# EAGLE schematic TCU_UCU_PCB_Rev2 (EAGLE 9.6.2)

## Sheet 1 of 7
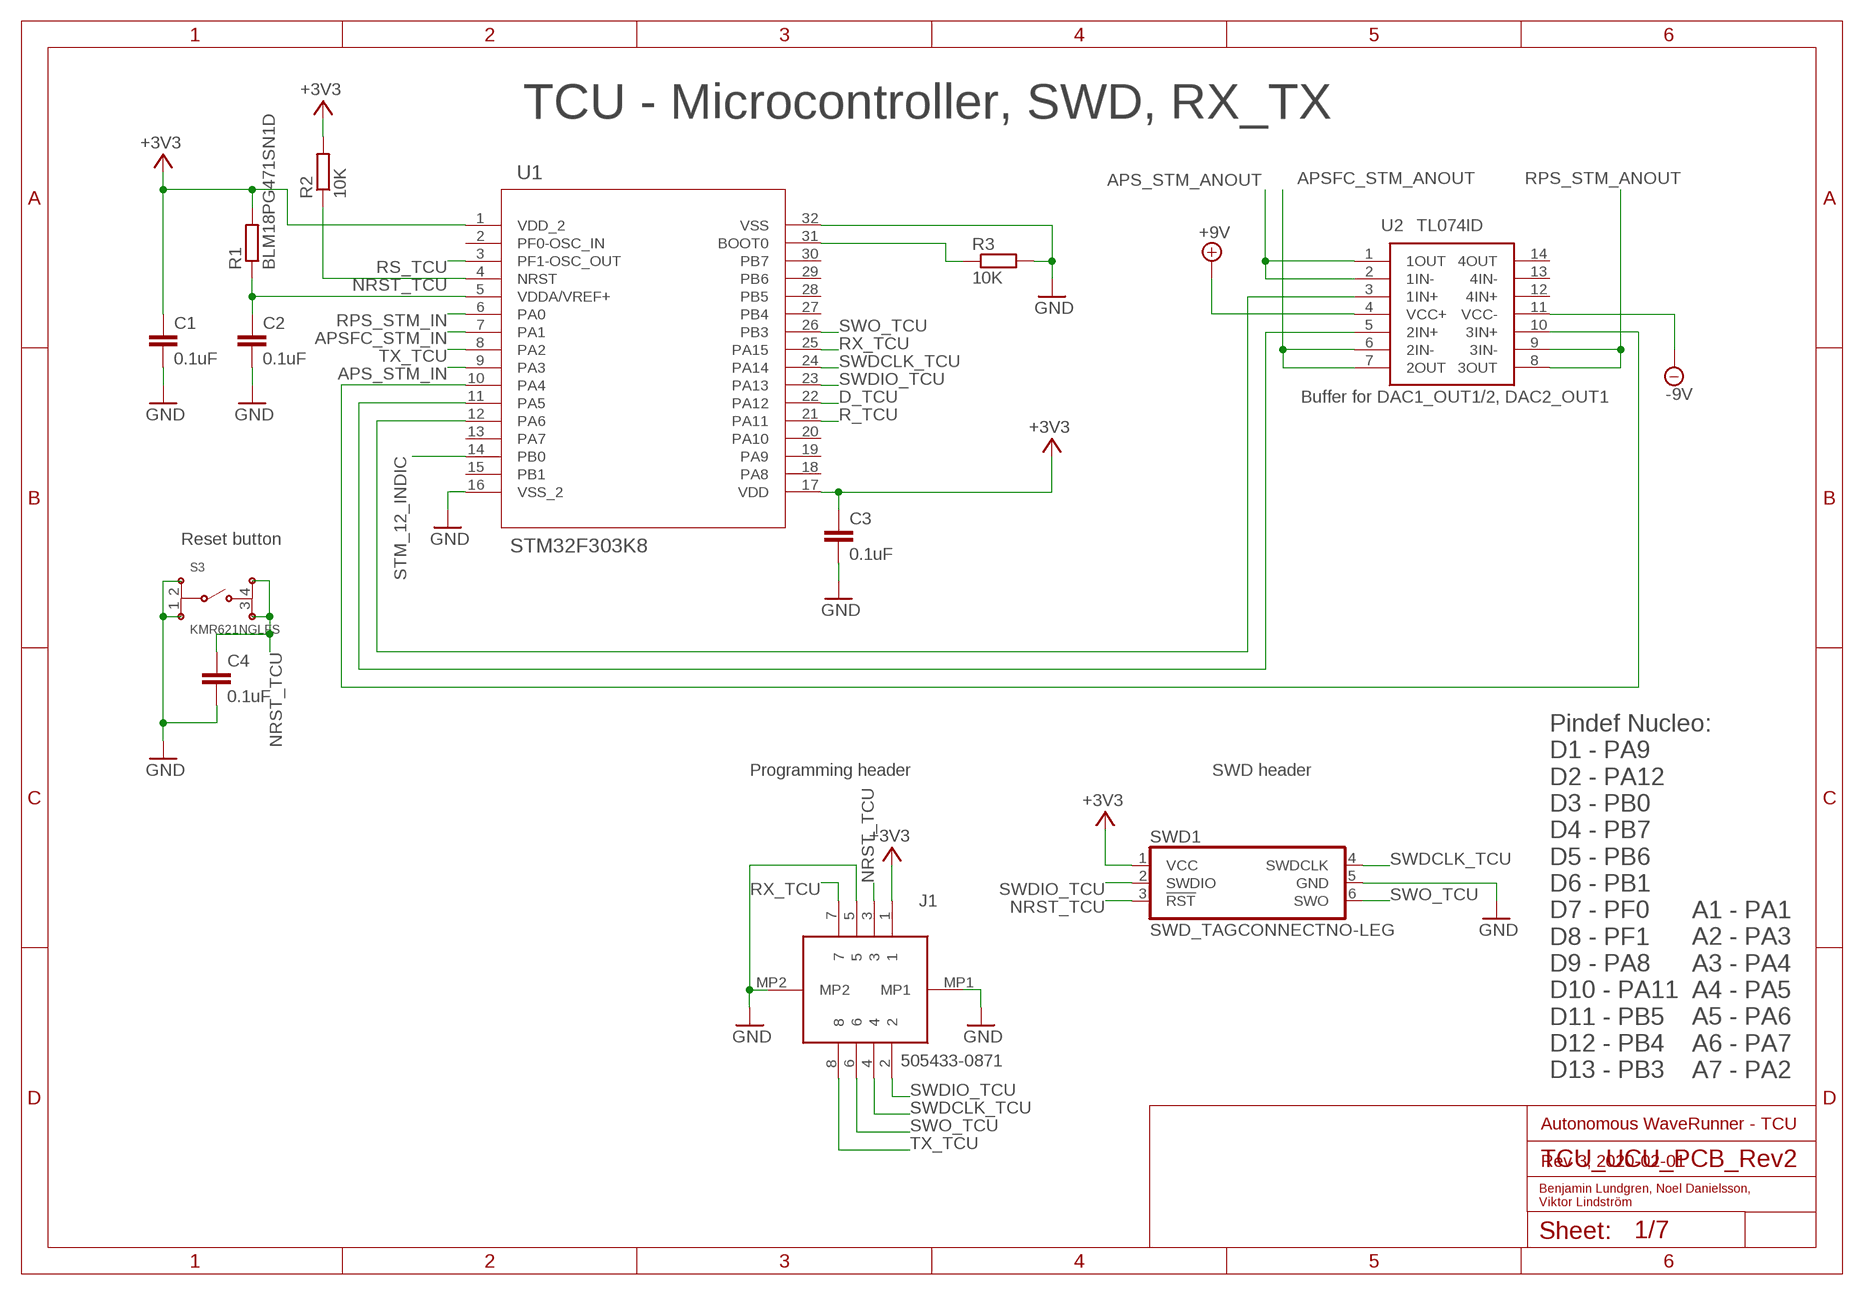
[diagram p0: schematic, sheet 1]

### Parts
C1  0.1uF  C0603  [C0603]
C2  0.1uF  C0603  [C0603]
C3  0.1uF  C0603  [C0603]
C4  0.1uF  C0603  [C0603]
J1  505433-0871  [5054330871]
R1  BLM18PG471SN1D  R0603  [R0603]
R2  10K  R0603  [R0603]
R3  10K  R0603  [R0603]
S3  KMR621NGLFS  [KMR621NGLFS]
SWD1  SWD_TAGCONNECTNO-LEG  [TC2030-IDC-NL]
U1  STM32F303K8  [LQFP-32]
U2  TL074ID  [SOIC127P600X175-14N]

### Nets
+3V3: C1.1 C3.1 J1.1 R1.2 R2.2 SWD1.1(VCC) U1.1(VDD_2) U1.17(VDD) ; also sheet 2,3,5,6,7
+9V: U2.4(VCC+) ; also sheet 3,4
-9V: U2.11(VCC-) ; also sheet 3,4
APS_STM_ANOUT: U2.1(1OUT) U2.2(1IN-) ; also sheet 4
APS_STM_IN: U1.9(PA3) ; also sheet 4
APSFC_STM_ANOUT: U2.6(2IN-) U2.7(2OUT) ; also sheet 4
APSFC_STM_IN: U1.7(PA1) ; also sheet 4
D_TCU: U1.22(PA12) ; also sheet 7
GND: C1.2 C2.2 C3.2 C4.2 J1.5 J1.MP1 J1.MP2 R3.2 S3.1 S3.2 SWD1.5(GND) U1.16(VSS_2) U1.32(VSS) ; also sheet 2,3,4,5,6,7
N$7: U1.11(PA5) U2.5(2IN+)
N$8: U1.12(PA6) U2.3(1IN+)
N$9: U1.10(PA4) U2.10(3IN+)
N$26: C2.1 R1.1 U1.5(VDDA/VREF+)
N$27: R3.1 U1.31(BOOT0)
NRST_TCU: C4.1 J1.3 R2.1 S3.3 S3.4 SWD1.3(!RST) U1.4(NRST)
R_TCU: U1.21(PA11) ; also sheet 7
RPS_STM_ANOUT: U2.8(3OUT) U2.9(3IN-) ; also sheet 4
RPS_STM_IN: U1.6(PA0) ; also sheet 4
RS_TCU: U1.3(PF1-OSC_OUT) ; also sheet 7
RX_TCU: J1.7 U1.25(PA15)
STM_12_INDIC: U1.14(PB0) ; also sheet 2,3,6
SWDCLK_TCU: J1.4 SWD1.4(SWDCLK) U1.24(PA14)
SWDIO_TCU: J1.2 SWD1.2(SWDIO) U1.23(PA13)
SWO_TCU: J1.6 SWD1.6(SWO) U1.26(PB3)
TX_TCU: J1.8 U1.8(PA2)
Unconnected: U1.2(PF0-OSC_IN) U1.13(PA7) U1.15(PB1) U1.18(PA8) U1.19(PA9) U1.20(PA10) U1.27(PB4) U1.28(PB5) U1.29(PB6) U1.30(PB7) U2.12(4IN+) U2.13(4IN-) U2.14(4OUT)

### Notes on the sheet
- TCU - Microcontroller, SWD, RX_TX
- Buffer for DAC1_OUT1/2, DAC2_OUT1
- Reset button
- Programming header | SWD header
- Pindef Nucleo:
  D1 - PA9
  D2 - PA12
  D3 - PB0
  D4 - PB7
  D5 - PB6
  D6 - PB1
  D7 - PF0
  D8 - PF1
  D9 - PA8
  D10 - PA11
  D11 - PB5
  D12 - PB4
  D13 - PB3
- A1 - PA1
  A2 - PA3
  A3 - PA4
  A4 - PA5
  A5 - PA6
  A6 - PA7
  A7 - PA2
- Autonomous WaveRunner - TCU
- Rev 3, 2020-02-01
- Benjamin Lundgren, Noel Danielsson, 
  Viktor Lindström

## Sheet 2 of 7
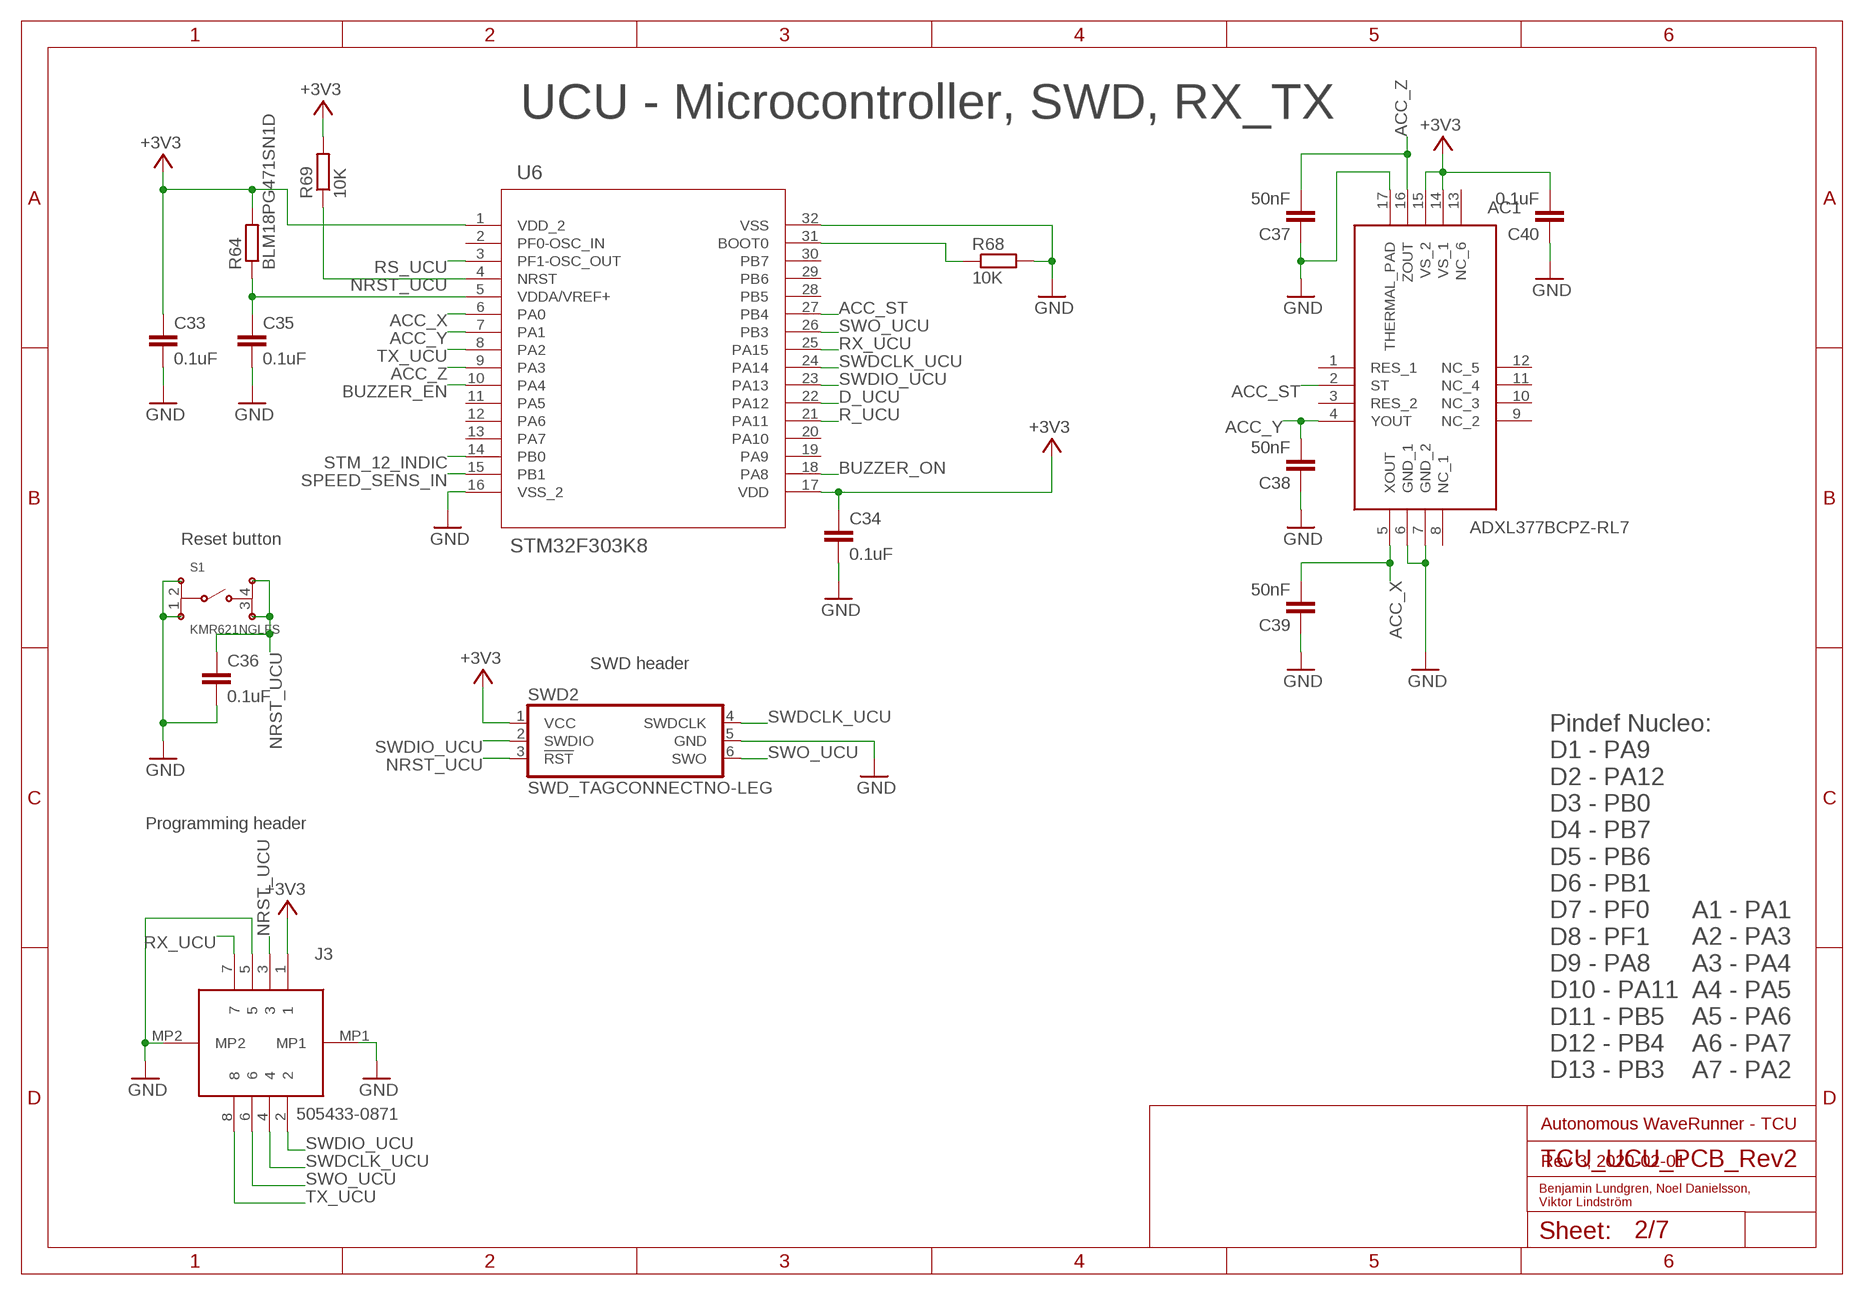
[diagram p1: schematic, sheet 2]

### Parts
AC1  ADXL377BCPZ-RL7  [QFN50P300X300X150-17N]
C33  0.1uF  C0603  [C0603]
C34  0.1uF  C0603  [C0603]
C35  0.1uF  C0603  [C0603]
C36  0.1uF  C0603  [C0603]
C37  50nF  C0603  [C0603]
C38  50nF  C0603  [C0603]
C39  50nF  C0603  [C0603]
C40  0.1uF  C0603  [C0603]
J3  505433-0871  [5054330871]
R64  BLM18PG471SN1D  R0603  [R0603]
R68  10K  R0603  [R0603]
R69  10K  R0603  [R0603]
S1  KMR621NGLFS  [KMR621NGLFS]
SWD2  SWD_TAGCONNECTNO-LEG  [TC2030-IDC-NL]
U6  STM32F303K8  [LQFP-32]

### Nets
+3V3: AC1.14(VS_1) AC1.15(VS_2) C33.1 C34.1 C40.2 J3.1 R64.2 R69.2 SWD2.1(VCC) U6.1(VDD_2) U6.17(VDD) ; also sheet 1,3,5,6,7
ACC_ST: AC1.2(ST) U6.27(PB4)
ACC_X: AC1.5(XOUT) C39.2 U6.6(PA0)
ACC_Y: AC1.4(YOUT) C38.2 U6.7(PA1)
ACC_Z: AC1.16(ZOUT) C37.2 U6.9(PA3)
BUZZER_EN: U6.10(PA4) ; also sheet 5
BUZZER_ON: U6.18(PA8) ; also sheet 5
D_UCU: U6.22(PA12) ; also sheet 7
GND: AC1.6(GND_1) AC1.7(GND_2) AC1.17(THERMAL_PAD) C33.2 C34.2 C35.2 C36.2 C37.1 C38.1 C39.1 C40.1 J3.5 J3.MP1 J3.MP2 R68.2 S1.1 S1.2 SWD2.5(GND) U6.16(VSS_2) U6.32(VSS) ; also sheet 1,3,4,5,6,7
N$40: C35.1 R64.1 U6.5(VDDA/VREF+)
N$61: R68.1 U6.31(BOOT0)
NRST_UCU: C36.1 J3.3 R69.1 S1.3 S1.4 SWD2.3(!RST) U6.4(NRST)
R_UCU: U6.21(PA11) ; also sheet 7
RS_UCU: U6.3(PF1-OSC_OUT) ; also sheet 7
RX_UCU: J3.7 U6.25(PA15)
SPEED_SENS_IN: U6.15(PB1) ; also sheet 5
STM_12_INDIC: U6.14(PB0) ; also sheet 1,3,6
SWDCLK_UCU: J3.4 SWD2.4(SWDCLK) U6.24(PA14)
SWDIO_UCU: J3.2 SWD2.2(SWDIO) U6.23(PA13)
SWO_UCU: J3.6 SWD2.6(SWO) U6.26(PB3)
TX_UCU: J3.8 U6.8(PA2)
Unconnected: AC1.1(RES_1) AC1.3(RES_2) AC1.8(NC_1) AC1.9(NC_2) AC1.10(NC_3) AC1.11(NC_4) AC1.12(NC_5) AC1.13(NC_6) U6.2(PF0-OSC_IN) U6.11(PA5) U6.12(PA6) U6.13(PA7) U6.19(PA9) U6.20(PA10) U6.28(PB5) U6.29(PB6) U6.30(PB7)

### Notes on the sheet
- UCU - Microcontroller, SWD, RX_TX
- Reset button
- SWD header
- Programming header
- Pindef Nucleo:
  D1 - PA9
  D2 - PA12
  D3 - PB0
  D4 - PB7
  D5 - PB6
  D6 - PB1
  D7 - PF0
  D8 - PF1
  D9 - PA8
  D10 - PA11
  D11 - PB5
  D12 - PB4
  D13 - PB3
- A1 - PA1
  A2 - PA3
  A3 - PA4
  A4 - PA5
  A5 - PA6
  A6 - PA7
  A7 - PA2
- Autonomous WaveRunner - TCU
- Rev 3, 2020-02-01
- Benjamin Lundgren, Noel Danielsson, 
  Viktor Lindström

## Sheet 3 of 7
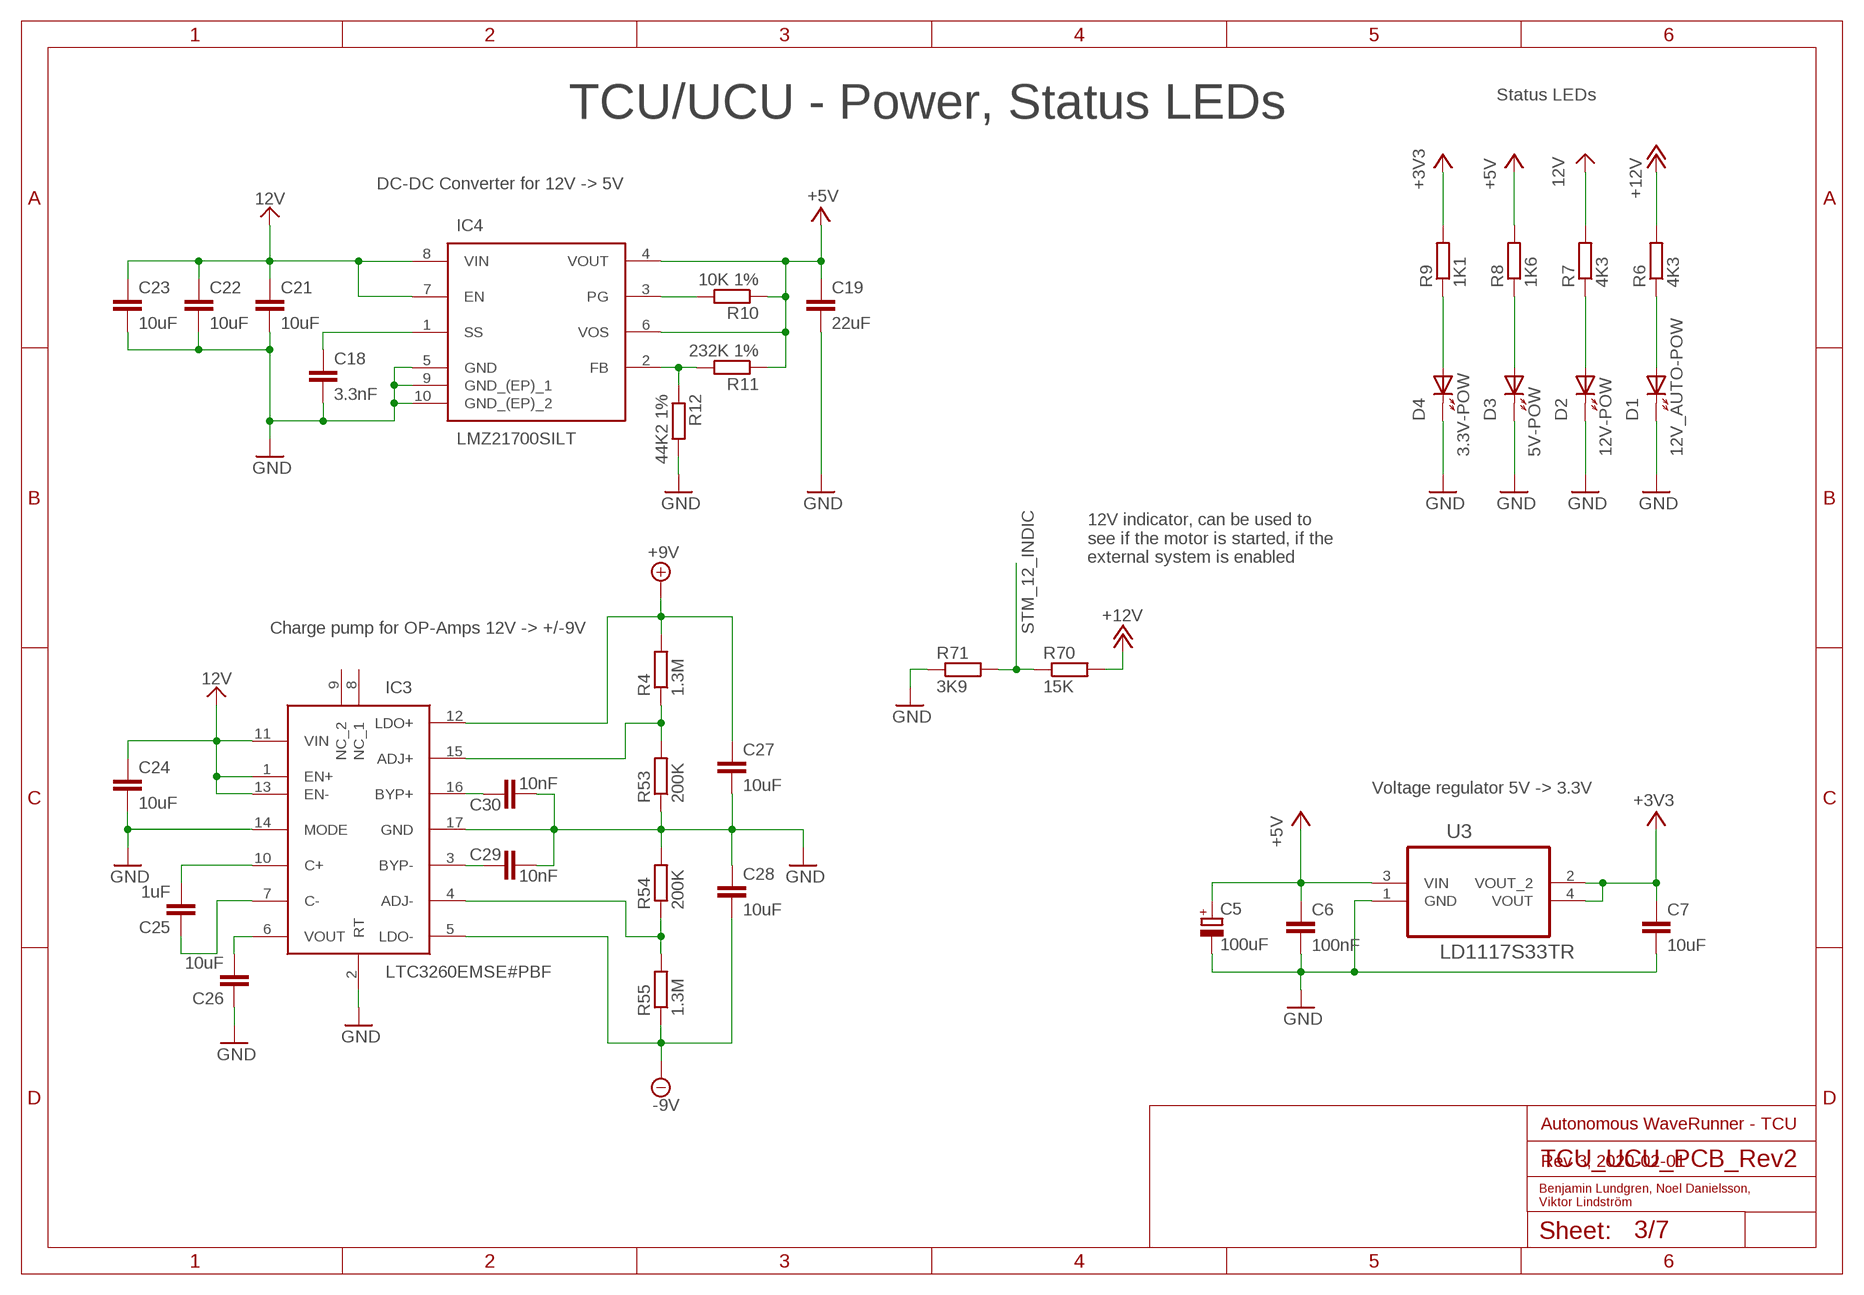
[diagram p2: schematic, sheet 3]

### Parts
C5  100uF  PANASONIC_C  [PANASONIC_C]
C6  100nF  C0603  [C0603]
C7  10uF  C0805  [C0805]
C18  3.3nF  C0603  [C0603]
C19  22uF  C0805  [C0805]
C21  10uF  C1206  [C1206]
C22  10uF  C1206  [C1206]
C23  10uF  C1206  [C1206]
C24  10uF  C1206  [C1206]
C25  1uF  C0805  [C0805]
C26  10uF  C1206  [C1206]
C27  10uF  C1206  [C1206]
C28  10uF  C1206  [C1206]
C29  10nF  C0603  [C0603]
C30  10nF  C0603  [C0603]
D1  12V_AUTO-POW  CHIP-LED0805  [CHIP-LED0805]
D2  12V-POW  CHIP-LED0805  [CHIP-LED0805]
D3  5V-POW  CHIP-LED0805  [CHIP-LED0805]
D4  3.3V-POW  CHIP-LED0805  [CHIP-LED0805]
IC3  LTC3260EMSE#PBF  [SOP50P490X110-17N]
IC4  LMZ21700SILT  [SIL0008E]
R4  1.3M  R0603  [R0603]
R6  4K3  R0603  [R0603]
R7  4K3  R0603  [R0603]
R8  1K6  R0603  [R0603]
R9  1K1  R0603  [R0603]
R10  10K 1%  R0603  [R0603]
R11  232K 1%  R0603  [R0603]
R12  44K2 1%  R0603  [R0603]
R53  200K  R0603  [R0603]
R54  200K  R0603  [R0603]
R55  1.3M  R0603  [R0603]
R70  15K  R0603  [R0603]
R71  3K9  R0603  [R0603]
U3  LD1117S33TR  [SOT230P700X180-4N]

### Nets
12V: C21.1 C22.1 C23.1 C24.1 IC3.1(EN+) IC3.11(VIN) IC3.13(EN-) IC4.7(EN) IC4.8(VIN) R7.2 ; also sheet 5,7
+3V3: C7.1 R9.2 U3.2(VOUT_2) U3.4(VOUT) ; also sheet 1,2,5,6,7
+5V: C5.+ C6.1 C19.1 IC4.4(VOUT) IC4.6(VOS) R8.2 R10.1 R11.1 U3.3(VIN) ; also sheet 5
+9V: C27.1 IC3.12(LDO+) R4.2 ; also sheet 1,4
+12V: R6.2 R70.2 ; also sheet 6,7
-9V: C28.2 IC3.5(LDO-) R55.1 ; also sheet 1,4
GND: C5.- C6.2 C7.2 C18.2 C19.2 C21.2 C22.2 C23.2 C24.2 C26.1 C27.2 C28.1 C29.2 C30.2 D1.C(K) D2.C(K) D3.C(K) D4.C(K) IC3.2(RT) IC3.14(MODE) IC3.17(GND) IC4.5(GND) IC4.9(GND_(EP)_1) IC4.10(GND_(EP)_2) R12.2 R53.1 R54.2 R71.1 U3.1(GND) ; also sheet 1,2,4,5,6,7
N$3: C25.2 IC3.10(C+)
N$4: D1.A R6.1
N$5: IC4.2(FB) R11.2 R12.1
N$6: C18.1 IC4.1(SS)
N$10: D2.A R7.1
N$11: IC4.3(PG) R10.2
N$12: C25.1 IC3.7(C-)
N$13: C26.2 IC3.6(VOUT)
N$14: IC3.15(ADJ+) R4.1 R53.2
N$16: IC3.4(ADJ-) R54.1 R55.2
N$17: D3.A R8.1
N$22: C30.1 IC3.16(BYP+)
N$23: C29.1 IC3.3(BYP-)
N$42: D4.A R9.1
STM_12_INDIC: R70.1 R71.2 ; also sheet 1,2,6
Unconnected: IC3.8(NC_1) IC3.9(NC_2)

### Notes on the sheet
- TCU/UCU - Power, Status LEDs | Status LEDs
- DC-DC Converter for 12V -> 5V
- 12V indicator, can be used to
  see if the motor is started, if the 
  external system is enabled
- Charge pump for OP-Amps 12V -> +/-9V
- Voltage regulator 5V -> 3.3V
- Autonomous WaveRunner - TCU
- Rev 3, 2020-02-01
- Benjamin Lundgren, Noel Danielsson, 
  Viktor Lindström

## Sheet 4 of 7
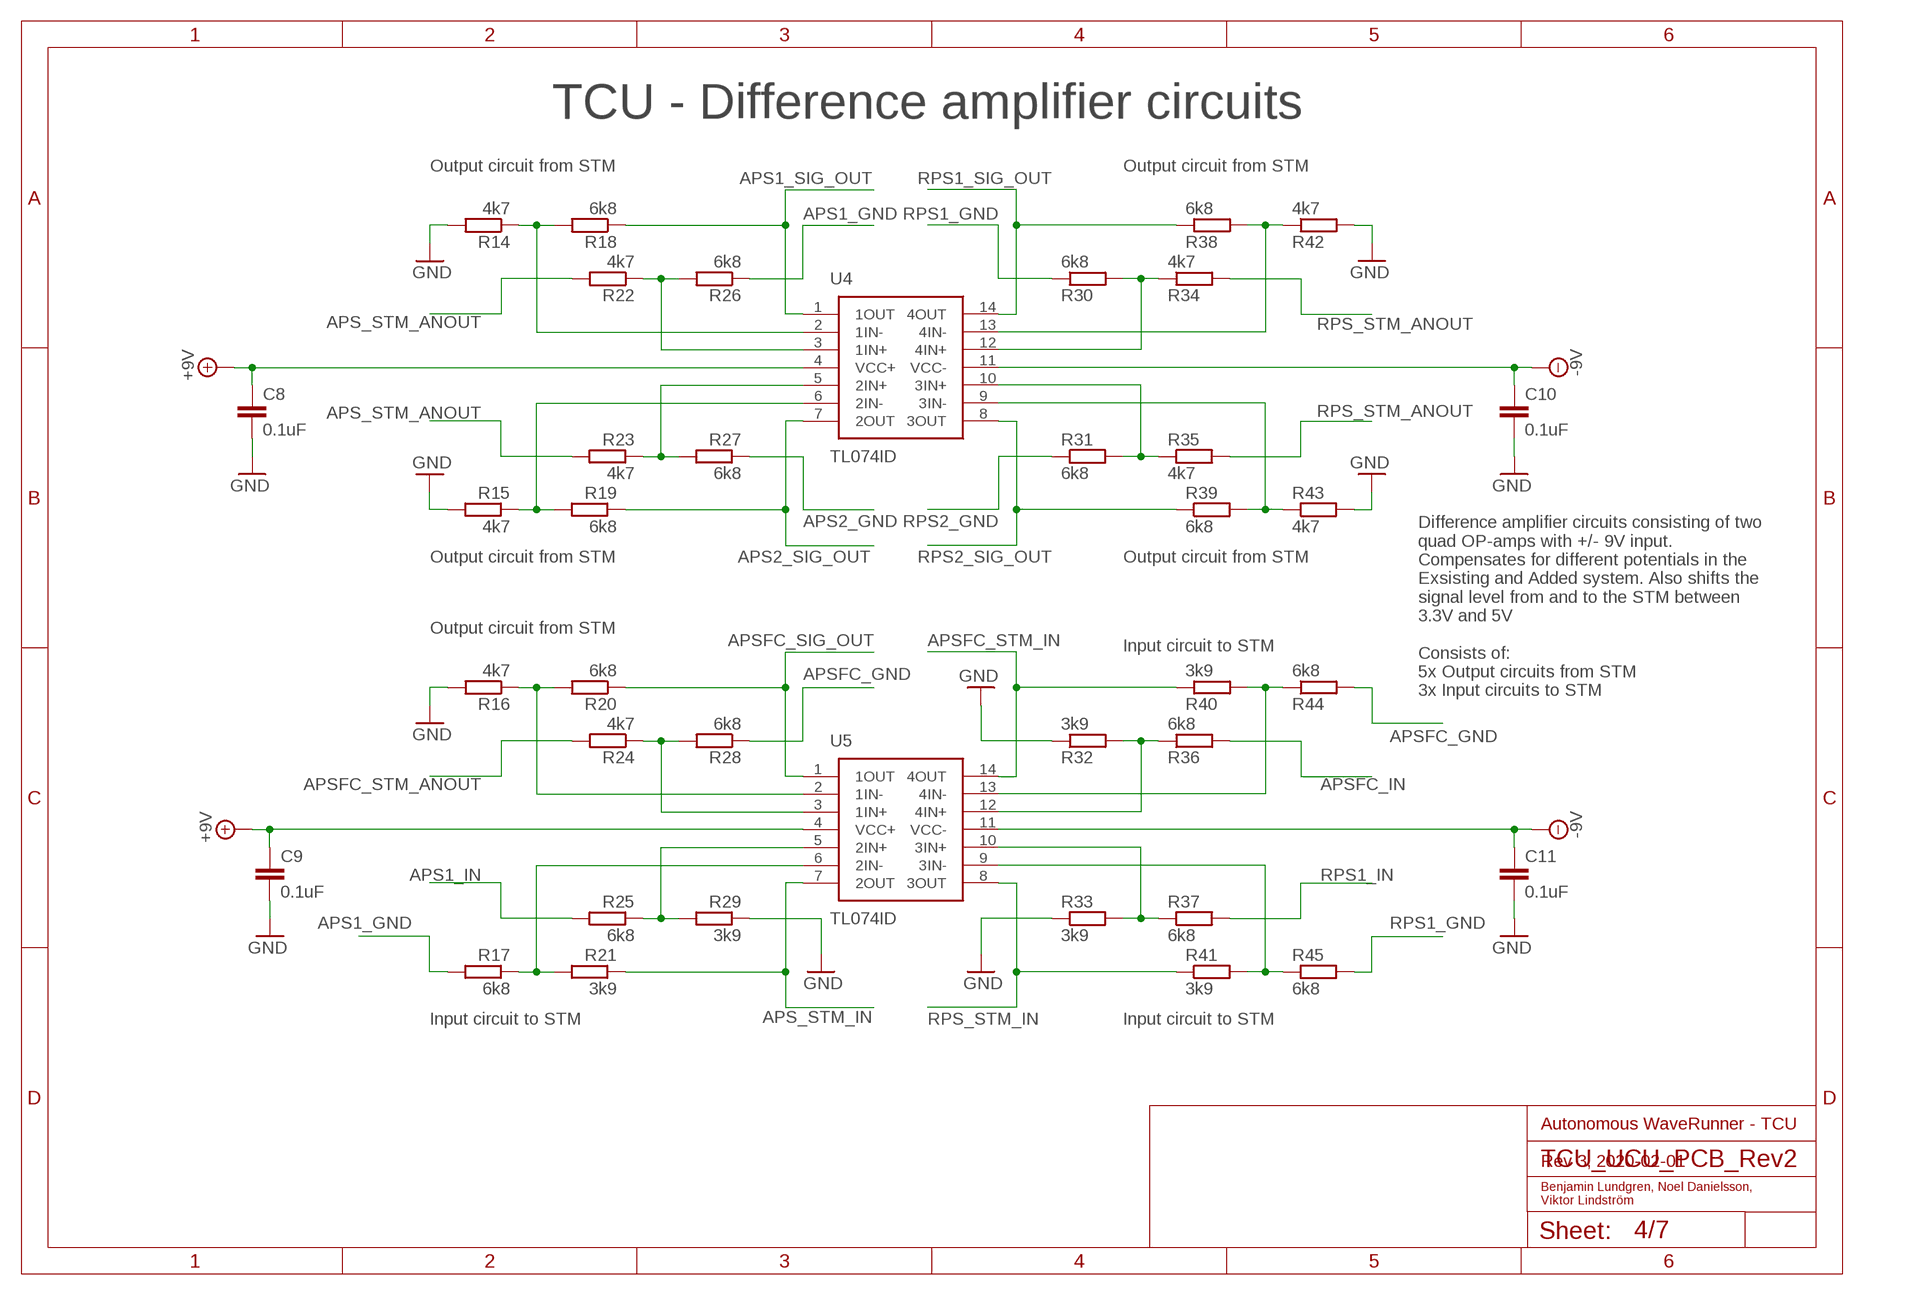
[diagram p3: schematic, sheet 4]

### Parts
C8  0.1uF  C0805  [C0805]
C9  0.1uF  C0805  [C0805]
C10  0.1uF  C0805  [C0805]
C11  0.1uF  C0805  [C0805]
R14  4k7  R0603  [R0603]
R15  4k7  R0603  [R0603]
R16  4k7  R0603  [R0603]
R17  6k8  R0603  [R0603]
R18  6k8  R0603  [R0603]
R19  6k8  R0603  [R0603]
R20  6k8  R0603  [R0603]
R21  3k9  R0603  [R0603]
R22  4k7  R0603  [R0603]
R23  4k7  R0603  [R0603]
R24  4k7  R0603  [R0603]
R25  6k8  R0603  [R0603]
R26  6k8  R0603  [R0603]
R27  6k8  R0603  [R0603]
R28  6k8  R0603  [R0603]
R29  3k9  R0603  [R0603]
R30  6k8  R0603  [R0603]
R31  6k8  R0603  [R0603]
R32  3k9  R0603  [R0603]
R33  3k9  R0603  [R0603]
R34  4k7  R0603  [R0603]
R35  4k7  R0603  [R0603]
R36  6k8  R0603  [R0603]
R37  6k8  R0603  [R0603]
R38  6k8  R0603  [R0603]
R39  6k8  R0603  [R0603]
R40  3k9  R0603  [R0603]
R41  3k9  R0603  [R0603]
R42  4k7  R0603  [R0603]
R43  4k7  R0603  [R0603]
R44  6k8  R0603  [R0603]
R45  6k8  R0603  [R0603]
U4  TL074ID  [SOIC127P600X175-14N]
U5  TL074ID  [SOIC127P600X175-14N]

### Nets
+9V: C8.1 C9.1 U4.4(VCC+) U5.4(VCC+) ; also sheet 1,3
-9V: C10.1 C11.1 U4.11(VCC-) U5.11(VCC-) ; also sheet 1,3
APS1_GND: R17.2 R26.1 ; also sheet 6
APS1_IN: R25.2 ; also sheet 6
APS1_SIG_OUT: R18.1 U4.1(1OUT) ; also sheet 6
APS2_GND: R27.1 ; also sheet 6
APS2_SIG_OUT: R19.1 U4.7(2OUT) ; also sheet 6
APS_STM_ANOUT: R22.2 R23.2 ; also sheet 1
APS_STM_IN: R21.1 U5.7(2OUT) ; also sheet 1
APSFC_GND: R28.1 R44.2 ; also sheet 6
APSFC_IN: R36.2 ; also sheet 6
APSFC_SIG_OUT: R20.1 U5.1(1OUT) ; also sheet 6
APSFC_STM_ANOUT: R24.2 ; also sheet 1
APSFC_STM_IN: R40.1 U5.14(4OUT) ; also sheet 1
GND: C8.2 C9.2 C10.2 C11.2 R14.2 R15.2 R16.2 R29.1 R32.1 R33.1 R42.2 R43.2 ; also sheet 1,2,3,5,6,7
N$31: R22.1 R26.2 U4.3(1IN+)
N$33: R14.1 R18.2 U4.2(1IN-)
N$39: R31.2 R35.1 U4.10(3IN+)
N$43: R39.2 R43.1 U4.9(3IN-)
N$44: R30.2 R34.1 U4.12(4IN+)
N$45: R38.2 R42.1 U4.13(4IN-)
N$46: R23.1 R27.2 U4.5(2IN+)
N$47: R15.1 R19.2 U4.6(2IN-)
N$48: R24.1 R28.2 U5.3(1IN+)
N$49: R16.1 R20.2 U5.2(1IN-)
N$50: R33.2 R37.1 U5.10(3IN+)
N$51: R41.2 R45.1 U5.9(3IN-)
N$52: R32.2 R36.1 U5.12(4IN+)
N$53: R40.2 R44.1 U5.13(4IN-)
N$54: R25.1 R29.2 U5.5(2IN+)
N$55: R17.1 R21.2 U5.6(2IN-)
RPS1_GND: R30.1 R45.2 ; also sheet 6
RPS1_IN: R37.2 ; also sheet 6
RPS1_SIG_OUT: R38.1 U4.14(4OUT) ; also sheet 6
RPS2_GND: R31.1 ; also sheet 6
RPS2_SIG_OUT: R39.1 U4.8(3OUT) ; also sheet 6
RPS_STM_ANOUT: R34.2 R35.2 ; also sheet 1
RPS_STM_IN: R41.1 U5.8(3OUT) ; also sheet 1

### Notes on the sheet
- TCU - Difference amplifier circuits
- Output circuit from STM | Output circuit from STM
- Output circuit from STM | Output circuit from STM
- Output circuit from STM
- Input circuit to STM
- Difference amplifier circuits consisting of two 
  quad OP-amps with +/- 9V input. 
  Compensates for different potentials in the 
  Exsisting and Added system. Also shifts the 
  signal level from and to the STM between 
  3.3V and 5V
  
  Consists of:
  5x Output circuits from STM
  3x Input circuits to STM
- Input circuit to STM | Input circuit to STM
- Autonomous WaveRunner - TCU
- Rev 3, 2020-02-01
- Benjamin Lundgren, Noel Danielsson, 
  Viktor Lindström

## Sheet 5 of 7
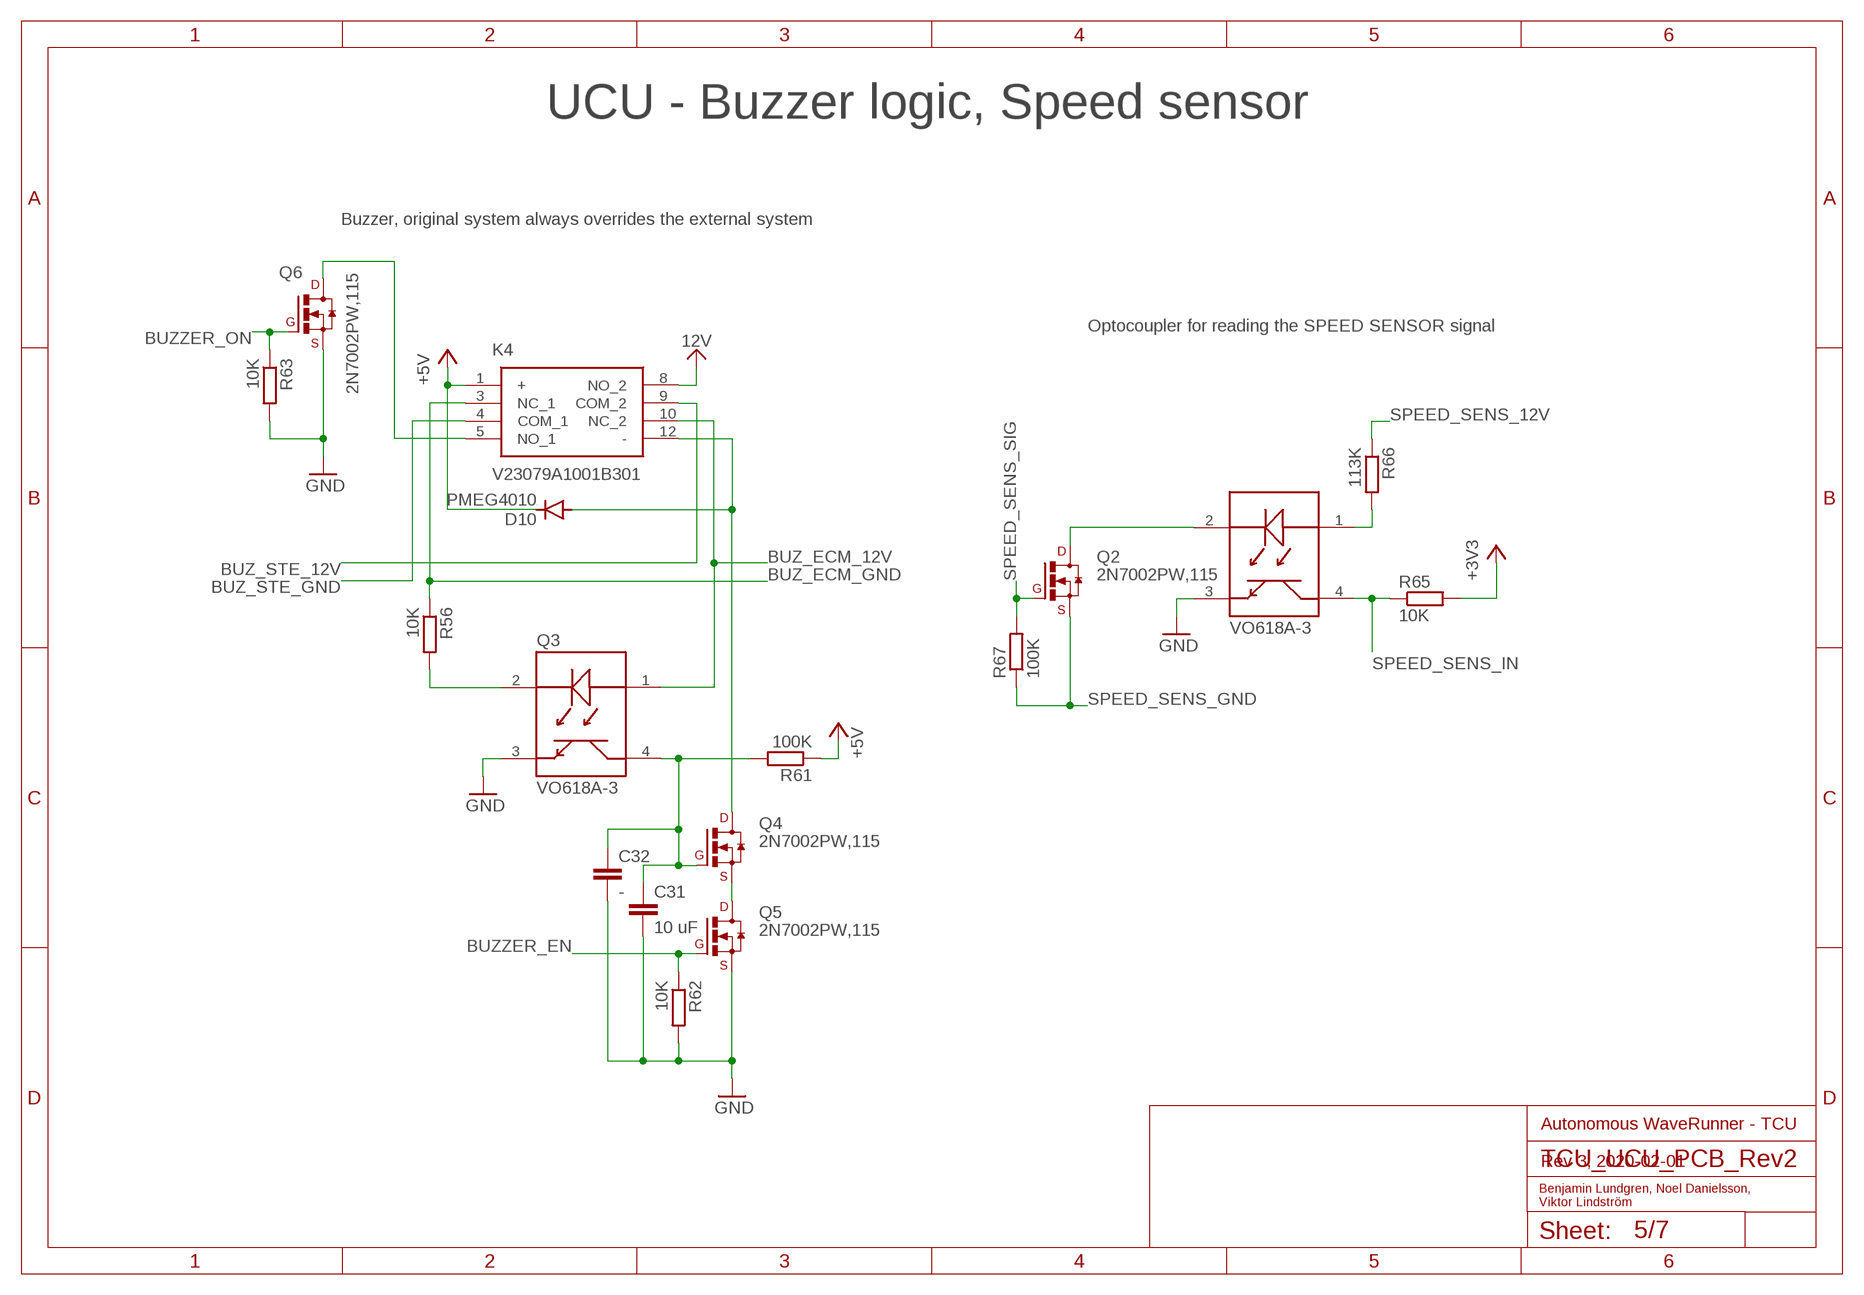
[diagram p4: schematic, sheet 5]

### Parts
C31  10 uF  C0805  [C0805]
C32  -  C1206  [C1206]
D10  PMEG4010  DIODE-SOD123  [SOD123]
K4  V23079A1001B301  [413937885]
Q2  2N7002PW,115  [SOT323]
Q3  VO618A-3  [DIL04-400]
Q4  2N7002PW,115  [SOT323]
Q5  2N7002PW,115  [SOT323]
Q6  2N7002PW,115  [SOT323]
Q7  VO618A-3  [DIL04-400]
R56  10K  R0603  [R0603]
R61  100K  R0603  [R0603]
R62  10K  R0603  [R0603]
R63  10K  R0603  [R0603]
R65  10K  R0603  [R0603]
R66  113K  R0603  [R0603]
R67  100K  R0603  [R0603]

### Nets
12V: K4.8(NO_2) ; also sheet 3,7
+3V3: R65.2 ; also sheet 1,2,3,6,7
+5V: D10.C K4.1(+) R61.1 ; also sheet 3
BUZ_ECM_12V: K4.10(NC_2) Q3.1(1A) ; also sheet 6
BUZ_ECM_GND: K4.3(NC_1) R56.1 ; also sheet 6
BUZ_STE_12V: K4.9(COM_2) ; also sheet 6
BUZ_STE_GND: K4.4(COM_1) ; also sheet 6
BUZZER_EN: Q5.1(G) R62.1 ; also sheet 2
BUZZER_ON: Q6.1(G) R63.1 ; also sheet 2
GND: C31.2 C32.2 Q3.3(3E) Q5.2(S) Q6.2(S) Q7.3(3E) R62.2 R63.2 ; also sheet 1,2,3,4,6,7
N$1: Q2.3(D) Q7.2(2C)
N$2: Q7.1(1A) R66.2
N$29: C31.1 C32.1 Q3.4(4C) Q4.1(G) R61.2
N$32: D10.A K4.12(-) Q4.3(D)
N$35: Q4.2(S) Q5.3(D)
N$41: K4.5(NO_1) Q6.3(D)
N$56: Q3.2(2C) R56.2
SPEED_SENS_12V: R66.1 ; also sheet 6
SPEED_SENS_GND: Q2.2(S) R67.1 ; also sheet 6
SPEED_SENS_IN: Q7.4(4C) R65.1 ; also sheet 2
SPEED_SENS_SIG: Q2.1(G) R67.2 ; also sheet 6

### Notes on the sheet
- UCU - Buzzer logic, Speed sensor
- Buzzer, original system always overrides the external system
- Optocoupler for reading the SPEED SENSOR signal
- Autonomous WaveRunner - TCU
- Rev 3, 2020-02-01
- Benjamin Lundgren, Noel Danielsson, 
  Viktor Lindström

## Sheet 6 of 7
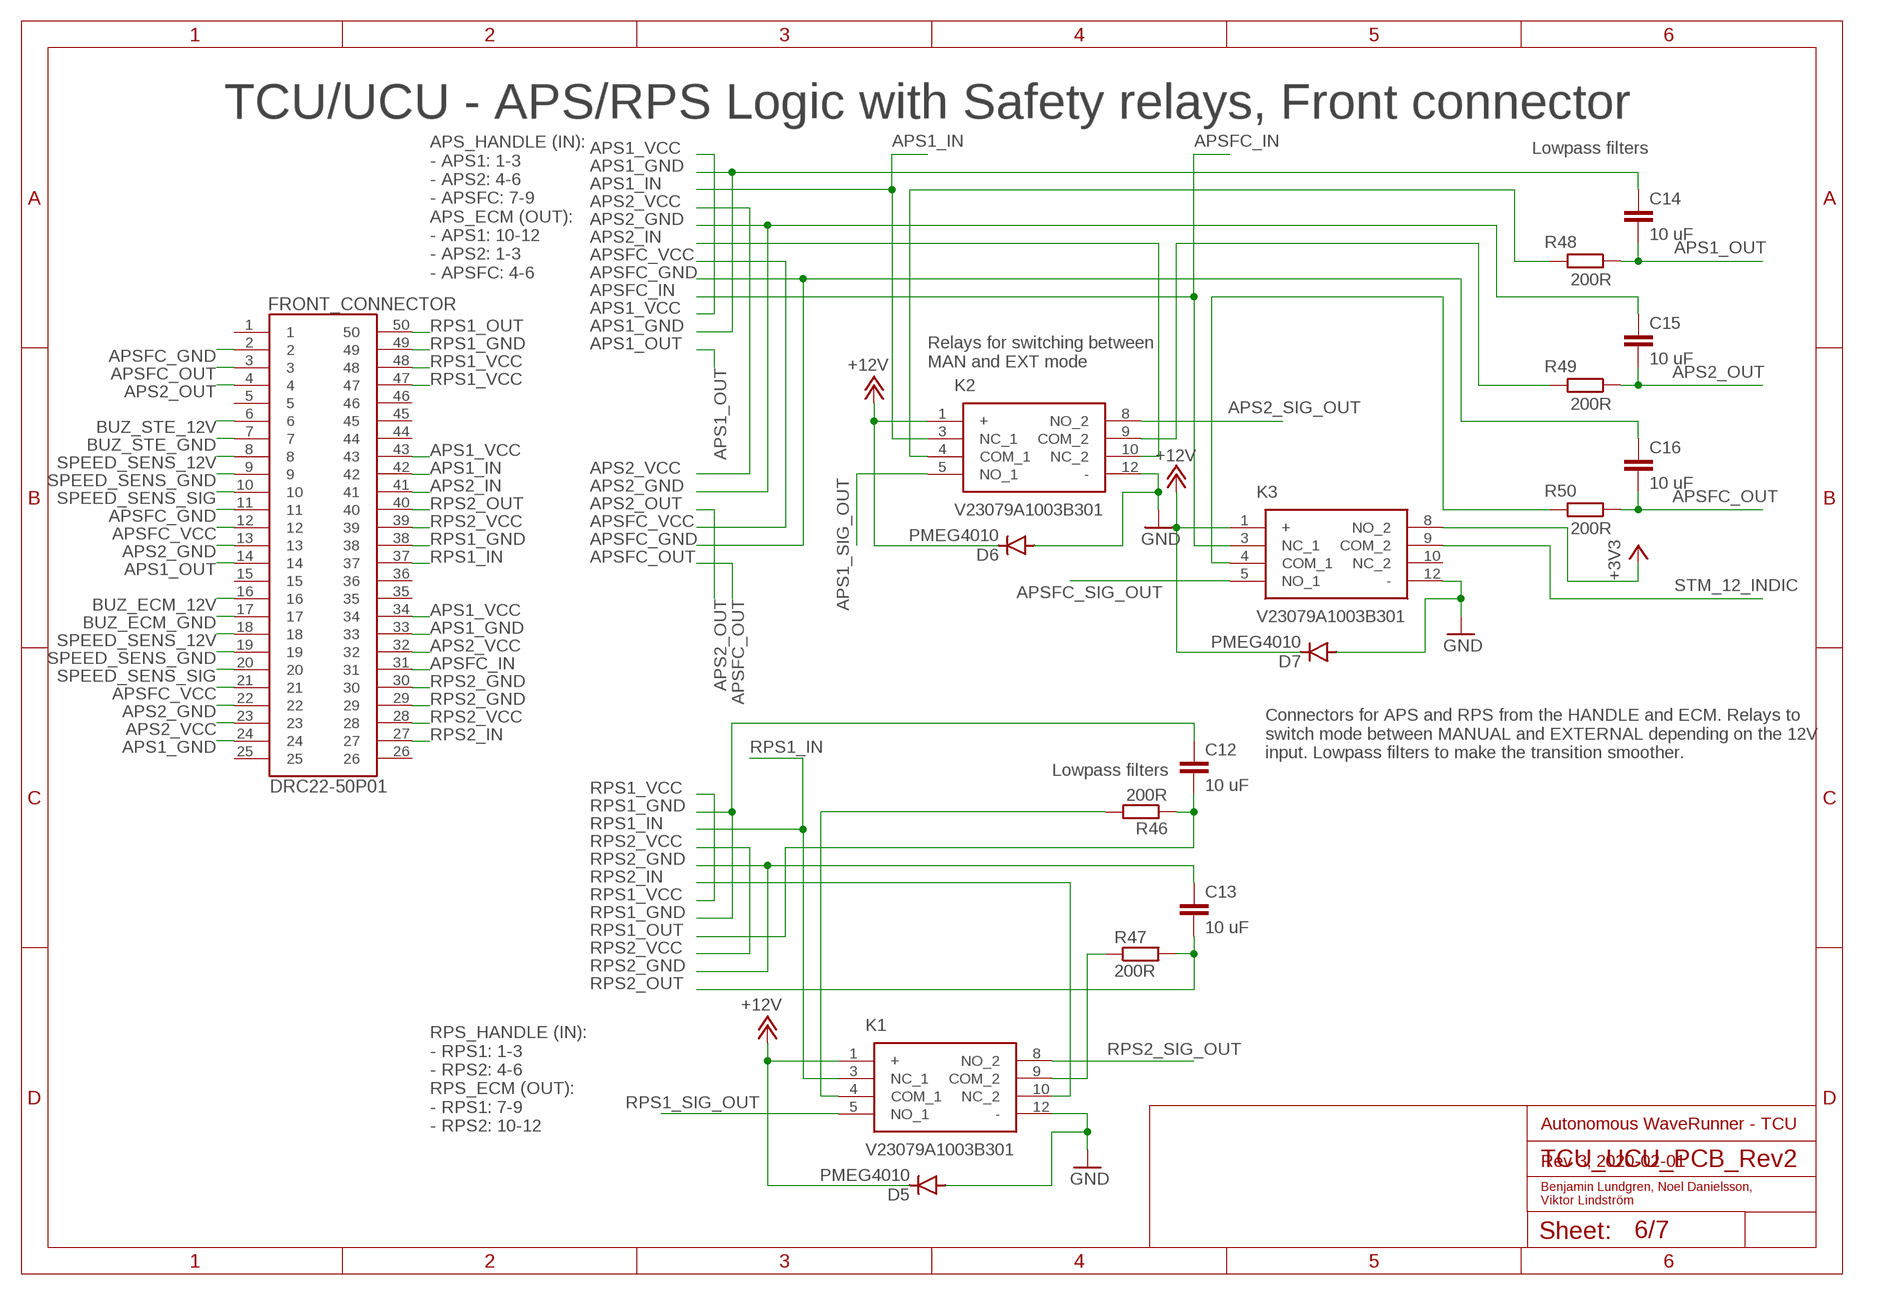
[diagram p5: schematic, sheet 6]

### Parts
C12  10 uF  C0805  [C0805]
C13  10 uF  C0805  [C0805]
C14  10 uF  C0805  [C0805]
C15  10 uF  C0805  [C0805]
C16  10 uF  C0805  [C0805]
D5  PMEG4010  DIODE-SOD123  [SOD123]
D6  PMEG4010  DIODE-SOD123  [SOD123]
D7  PMEG4010  DIODE-SOD123  [SOD123]
FRONT_CONNECTOR  DRC22-50P01  [TE_DRC22-50P01]
K1  V23079A1003B301  [413937885]
K2  V23079A1003B301  [413937885]
K3  V23079A1003B301  [413937885]
R46  200R  R0603  [R0603]
R47  200R  R0603  [R0603]
R48  200R  R0603  [R0603]
R49  200R  R0603  [R0603]
R50  200R  R0603  [R0603]

### Nets
+3V3: K3.8(NO_2) ; also sheet 1,2,3,5,7
+12V: D5.C D6.C D7.C K1.1(+) K2.1(+) K3.1(+) ; also sheet 3,7
APS1_GND: C14.1 FRONT_CONNECTOR.24 FRONT_CONNECTOR.33 ; also sheet 4
APS1_IN: FRONT_CONNECTOR.42 K2.3(NC_1) ; also sheet 4
APS1_OUT: C14.2 FRONT_CONNECTOR.14 R48.1
APS1_SIG_OUT: K2.5(NO_1) ; also sheet 4
APS1_VCC: FRONT_CONNECTOR.34 FRONT_CONNECTOR.43
APS2_GND: C15.1 FRONT_CONNECTOR.13 FRONT_CONNECTOR.22 ; also sheet 4
APS2_IN: FRONT_CONNECTOR.41 K2.10(NC_2)
APS2_OUT: C15.2 FRONT_CONNECTOR.4 R49.1
APS2_SIG_OUT: K2.8(NO_2) ; also sheet 4
APS2_VCC: FRONT_CONNECTOR.23 FRONT_CONNECTOR.32
APSFC_GND: C16.1 FRONT_CONNECTOR.2 FRONT_CONNECTOR.11 ; also sheet 4
APSFC_IN: FRONT_CONNECTOR.31 K3.3(NC_1) ; also sheet 4
APSFC_OUT: C16.2 FRONT_CONNECTOR.3 R50.1
APSFC_SIG_OUT: K3.5(NO_1) ; also sheet 4
APSFC_VCC: FRONT_CONNECTOR.12 FRONT_CONNECTOR.21
BUZ_ECM_12V: FRONT_CONNECTOR.16 ; also sheet 5
BUZ_ECM_GND: FRONT_CONNECTOR.17 ; also sheet 5
BUZ_STE_12V: FRONT_CONNECTOR.6 ; also sheet 5
BUZ_STE_GND: FRONT_CONNECTOR.7 ; also sheet 5
GND: D5.A D6.A D7.A K1.12(-) K2.12(-) K3.12(-) ; also sheet 1,2,3,4,5,7
N$24: K1.4(COM_1) R46.2
N$30: K1.9(COM_2) R47.1
N$34: K2.4(COM_1) R48.2
N$36: K2.9(COM_2) R49.2
N$38: K3.4(COM_1) R50.2
RPS1_GND: C12.1 FRONT_CONNECTOR.38 FRONT_CONNECTOR.49 ; also sheet 4
RPS1_IN: FRONT_CONNECTOR.37 K1.3(NC_1) ; also sheet 4
RPS1_OUT: C12.2 FRONT_CONNECTOR.50 R46.1
RPS1_SIG_OUT: K1.5(NO_1) ; also sheet 4
RPS1_VCC: FRONT_CONNECTOR.47 FRONT_CONNECTOR.48
RPS2_GND: C13.1 FRONT_CONNECTOR.29 FRONT_CONNECTOR.30 ; also sheet 4
RPS2_IN: FRONT_CONNECTOR.27 K1.10(NC_2)
RPS2_OUT: C13.2 FRONT_CONNECTOR.40 R47.2
RPS2_SIG_OUT: K1.8(NO_2) ; also sheet 4
RPS2_VCC: FRONT_CONNECTOR.28 FRONT_CONNECTOR.39
SPEED_SENS_12V: FRONT_CONNECTOR.8 FRONT_CONNECTOR.18 ; also sheet 5
SPEED_SENS_GND: FRONT_CONNECTOR.9 FRONT_CONNECTOR.19 ; also sheet 5
SPEED_SENS_SIG: FRONT_CONNECTOR.10 FRONT_CONNECTOR.20 ; also sheet 5
STM_12_INDIC: K3.9(COM_2) ; also sheet 1,2,3
Unconnected: FRONT_CONNECTOR.1 FRONT_CONNECTOR.5 FRONT_CONNECTOR.15 FRONT_CONNECTOR.25 FRONT_CONNECTOR.26 FRONT_CONNECTOR.35 FRONT_CONNECTOR.36 FRONT_CONNECTOR.44 FRONT_CONNECTOR.45 FRONT_CONNECTOR.46 K3.10(NC_2)

### Notes on the sheet
- TCU/UCU - APS/RPS Logic with Safety relays, Front connector
- Lowpass filters
- APS_HANDLE (IN):
  - APS1: 1-3 
  - APS2: 4-6
  - APSFC: 7-9
  APS_ECM (OUT):
  - APS1: 10-12
  - APS2: 1-3
  - APSFC: 4-6
- Relays for switching between 
  MAN and EXT mode
- Connectors for APS and RPS from the HANDLE and ECM. Relays to 
  switch mode between MANUAL and EXTERNAL depending on the 12V 
  input. Lowpass filters to make the transition smoother.
- Lowpass filters
- Autonomous WaveRunner - TCU
- RPS_HANDLE (IN):
  - RPS1: 1-3 
  - RPS2: 4-6
  RPS_ECM (OUT):
  - RPS1: 7-9
  - RPS2: 10-12
- Rev 3, 2020-02-01
- Benjamin Lundgren, Noel Danielsson, 
  Viktor Lindström

## Sheet 7 of 7
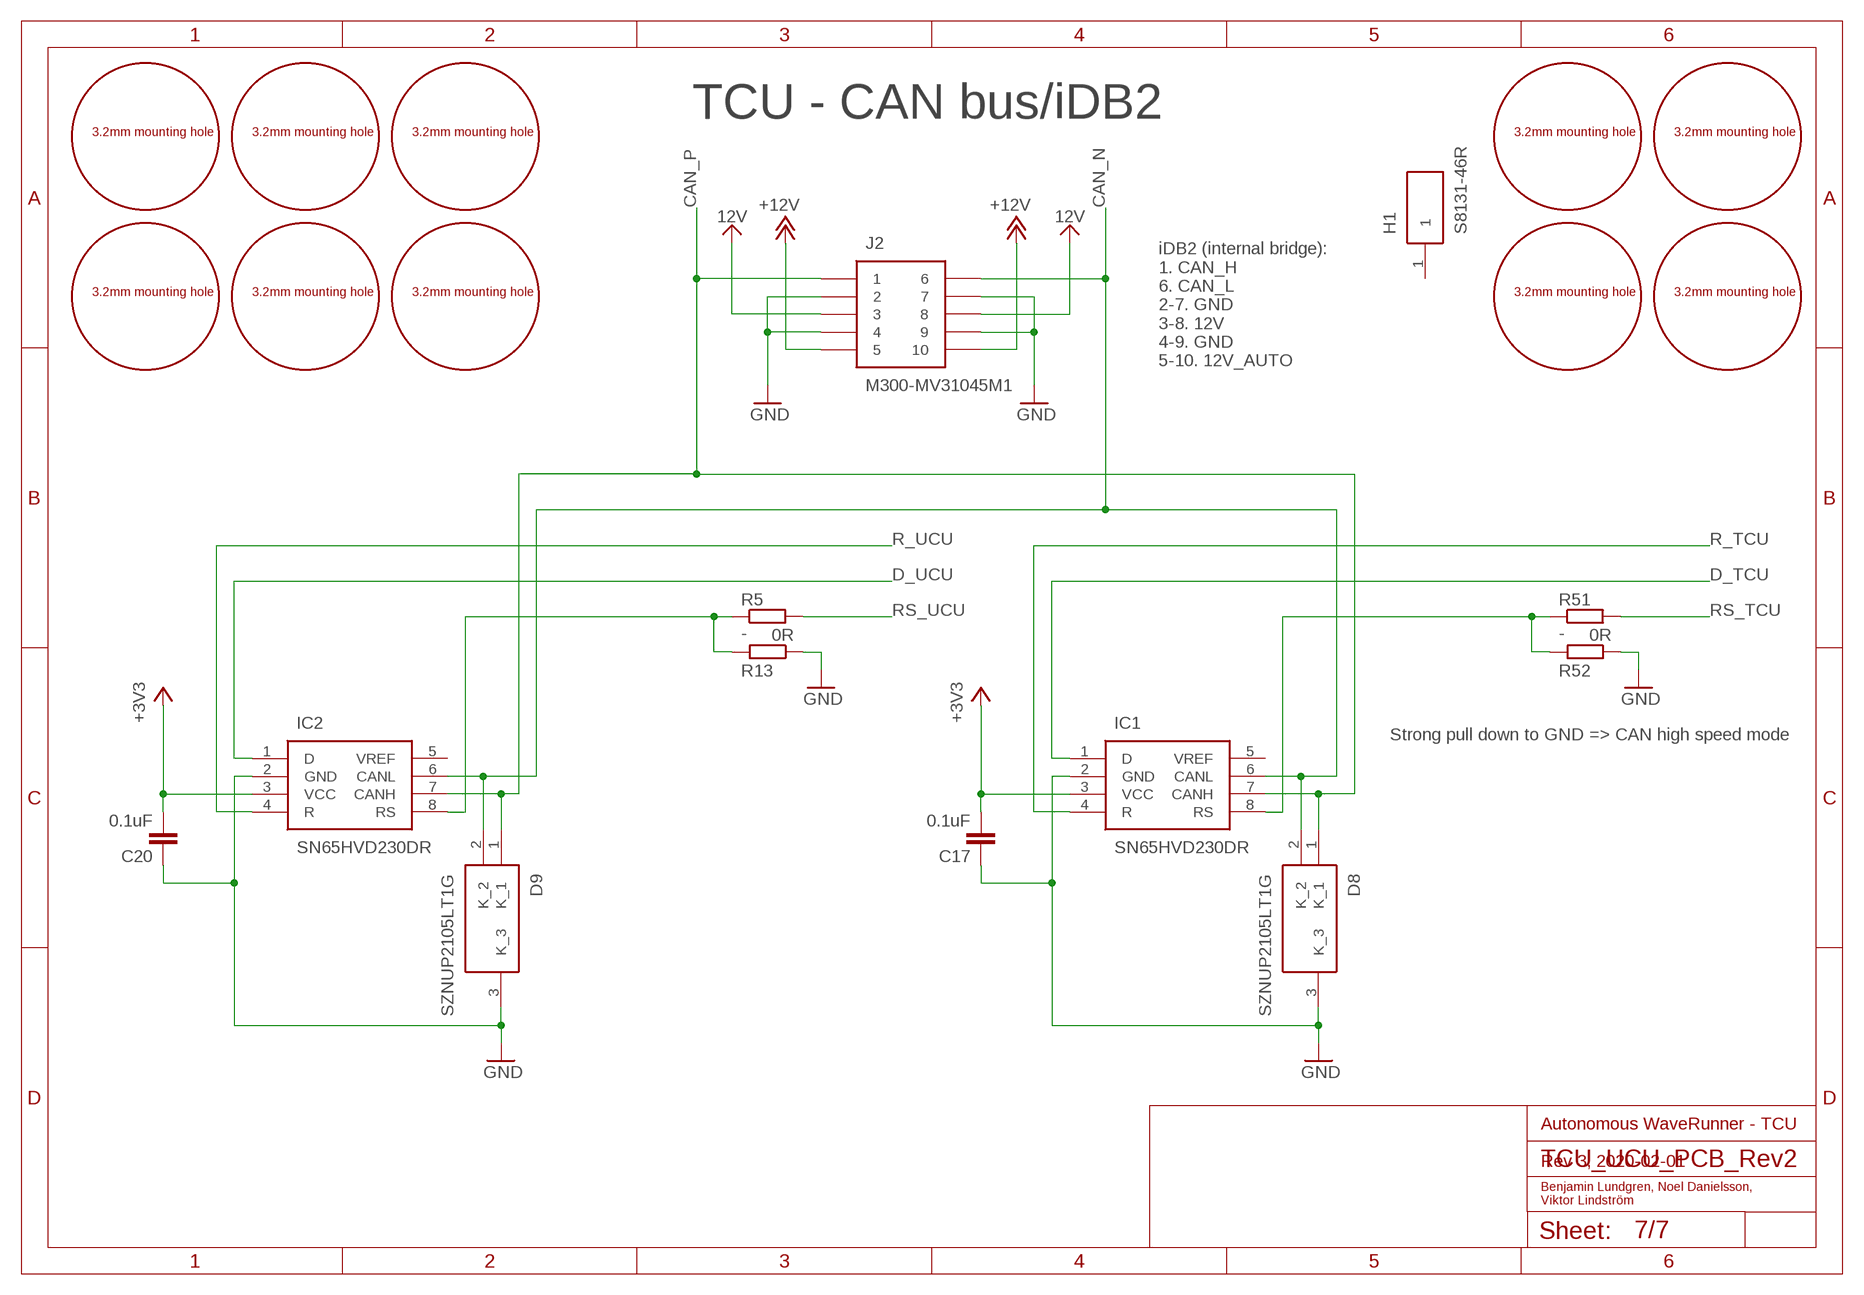
[diagram p6: schematic, sheet 7]

### Parts
C17  0.1uF  C0603  [C0603]
C20  0.1uF  C0603  [C0603]
D8  SZNUP2105LT1G  [SOT96P237X111-3N]
D9  SZNUP2105LT1G  [SOT96P237X111-3N]
H1  S8131-46R  [S813146R]
IC1  SN65HVD230DR  [SOT127P600X175-8N]
IC2  SN65HVD230DR  [SOT127P600X175-8N]
J2  M300-MV31045M1  [M300MV31045M1]
R5  -  R0603  [R0603]
R13  0R  R0603  [R0603]
R51  -  R0603  [R0603]
R52  0R  R0603  [R0603]
U$1  M3_MOUNTING_HOLE  [M3_MOUNTING_HOLE]
U$2  M3_MOUNTING_HOLE  [M3_MOUNTING_HOLE]
U$3  M3_MOUNTING_HOLE  [M3_MOUNTING_HOLE]
U$4  M3_MOUNTING_HOLE  [M3_MOUNTING_HOLE]
U$5  M3_MOUNTING_HOLE  [M3_MOUNTING_HOLE]
U$6  M3_MOUNTING_HOLE  [M3_MOUNTING_HOLE]
U$7  M3_MOUNTING_HOLE  [M3_MOUNTING_HOLE]
U$8  M3_MOUNTING_HOLE  [M3_MOUNTING_HOLE]
U$9  M3_MOUNTING_HOLE  [M3_MOUNTING_HOLE]
U$10  M3_MOUNTING_HOLE  [M3_MOUNTING_HOLE]

### Nets
12V: J2.3 J2.8 ; also sheet 3,5
+3V3: C17.2 C20.2 IC1.3(VCC) IC2.3(VCC) ; also sheet 1,2,3,5,6
+12V: J2.5 J2.10 ; also sheet 3,6
CAN_N: D8.2(K_2) D9.2(K_2) IC1.6(CANL) IC2.6(CANL) J2.6
CAN_P: D8.1(K_1) D9.1(K_1) IC1.7(CANH) IC2.7(CANH) J2.1
D_TCU: IC1.1(D) ; also sheet 1
D_UCU: IC2.1(D) ; also sheet 2
GND: C17.1 C20.1 D8.3(K_3) D9.3(K_3) IC1.2(GND) IC2.2(GND) J2.2 J2.4 J2.7 J2.9 R13.1 R52.1 ; also sheet 1,2,3,4,5,6
N$15: IC1.8(RS) R51.1 R52.2
N$20: IC2.8(RS) R5.1 R13.2
R_TCU: IC1.4(R) ; also sheet 1
R_UCU: IC2.4(R) ; also sheet 2
RS_TCU: R51.2 ; also sheet 1
RS_UCU: R5.2 ; also sheet 2
Unconnected: H1.1 IC1.5(VREF) IC2.5(VREF)

### Notes on the sheet
- TCU - CAN bus/iDB2
- iDB2 (internal bridge):
  1. CAN_H
  6. CAN_L
  2-7. GND
  3-8. 12V
  4-9. GND
  5-10. 12V_AUTO
- Strong pull down to GND => CAN high speed mode
- Autonomous WaveRunner - TCU
- Rev 3, 2020-02-01
- Benjamin Lundgren, Noel Danielsson, 
  Viktor Lindström

## Library data of the parts
AC1 = RescueRunner:ADXL377BCPZ-RL7: Accelerometers 3-Axis High g Analog MEMS Source: Datasheet <http://uk.rs-online.com/web/p/products/1832638P>; DESCRIPTION: Accelerometers 3-Axis High g Analog MEMS; HEIGHT: 1.5mm; MANUFACTURER_NAME: Analog Devices; MANUFACTURER_PART_NUMBER: ADXL377BCPZ-RL7; RS_PART_NUMBER: 1832638P; RS_PRICE-STOCK: http://uk.rs-online.com/web/p/products/1832638P
C1-C4 C6 C17 C18 C20 C29 C30 C33-C40 = CASE-RCL:C0603: Standard Chip CAPACITOR 0605 (1608 Metric) Description: Standard Chip CAPACITOR 0605 (1608 Metric)
C5 = CASE-RCL:PANASONIC_C: Panasonic VS Type Aluminum Electrolytic SMD Capacitors Size C - (TEAPO D5) Description: Size C of VS type SMD capacitor from Panasonic. Diameter of cap = 5mm. (TEAPO D5) Links: TEAPO1 <http://www.farnell.com/datasheets/2622415.pdf?_ga=2.91453018.1951585514.1537363662-1535130828.1530438260> TEAPO2 <http://www.teapo.com.tw/WebSiteFile/Products/Product_Data/EV%20%20SPEC.pdf> PANASONIC <https://industrial.panasonic.com/cdbs/www-data/pdf/RDE0000/DME0000COL92.pdf>
C7-C16 C19 C25 C31 = CASE-RCL:C0805: Standard Chip CAPACITOR 0805 (2012 Metric) Description: Standard Chip CAPACITOR 0805 (2012 Metric)
C21-C24 C26-C28 C32 = CASE-RCL:C1206: Standard Chip CAPACITOR 1206 (3216 Metric) Description: Standard Chip CAPACITOR 1206 (3216 Metric)
D1-D4 = CASE-LED:CHIP-LED0805: CHIP-LED0805 (SMD) Description: Standard 0805 SMD CHIP-LED
D5-D7 D10 = diode:DIODE-: DIODE
D8 D9 = RescueRunner:SZNUP2105LT1G: Dual Bi-Directional TVS Diode, 350W peak, 3-pin SOT-23 Source: Datasheet <https://componentsearchengine.com/Datasheets/1/SZNUP2105LT1G.pdf>; DESCRIPTION: Dual Bi-Directional TVS Diode, 350W peak, 3-pin SOT-23; HEIGHT: 1.11mm; MANUFACTURER_NAME: ON Semiconductor; MANUFACTURER_PART_NUMBER: SZNUP2105LT1G; MOUSER_PART_NUMBER: 863-SZNUP2105LT1G; MOUSER_PRICE-STOCK: https://www.mouser.com/Search/Refine.aspx?Keyword=863-SZNUP2105LT1G
FRONT_CONNECTOR = RescueRunner:DRC22-50P01: 50 way DRC 01 key Receptacle with sealed inside flange and PCB mount, centerline pitch .174 inch/4.42 millimeters, an...; MANUFACTURER: TE Connectivity; PARTREV: E; STANDARD: Manufacturer Recommendation
H1 = RescueRunner:S8131-46R: HARWIN - S8131-46R - Fastener, Low Profile PCB, Surface Mount Cable Clamp, 1.8 mm, Copper, Grey, 10 mm, 8 mm Source: Datasheet <http://uk.rs-online.com/web/p/products/7884842P>; DESCRIPTION: HARWIN - S8131-46R - Fastener, Low Profile PCB, Surface Mount Cable Clamp, 1.8 mm, Copper, Grey, 10 mm, 8 mm; HEIGHT: 3.7mm; MANUFACTURER_NAME: HARWIN; MANUFACTURER_PART_NUMBER: S8131-46R; RS_PART_NUMBER: 7884842P; RS_PRICE-STOCK: http://uk.rs-online.com/web/p/products/7884842P
IC1 IC2 = RescueRunner:SN65HVD230DR: 3.3 V CAN Transceiver with Standby Mode Source: Datasheet <http://www.ti.com/lit/gpn/sn65hvd230>; DESCRIPTION: 3.3 V CAN Transceiver with Standby Mode; HEIGHT: 1.75mm; MANUFACTURER_NAME: Texas Instruments; MANUFACTURER_PART_NUMBER: SN65HVD230DR; MOUSER_PART_NUMBER: 595-SN65HVD230DR; MOUSER_PRICE-STOCK: https://www.mouser.com/Search/Refine.aspx?Keyword=595-SN65HVD230DR
IC3 = RescueRunner:LTC3260EMSE#PBF: LTC3260,Charge Pump Inverter,MSOP EP-16 Linear Technology LTC3260EMSE#PBF, Charge Pump Inverting 100mA 550 kHz, -4.5 -32 V, 16-Pin, MSOP Source: Datasheet <http://uk.rs-online.com/web/p/products/8516768P>; DESCRIPTION: LTC3260,Charge Pump Inverter,MSOP EP-16 Linear Technology LTC3260EMSE#PBF, Charge Pump Inverting 100mA 550 kHz, -4.5 -32 V, 16-Pin, MSOP; HEIGHT: 1.1mm; MANUFACTURER_NAME: Linear Technology; MANUFACTURER_PART_NUMBER: LTC3260EMSE#PBF; RS_PART_NUMBER: 8516768P; RS_PRICE-STOCK: http://uk.rs-online.com/web/p/products/8516768P
IC4 = RescueRunner:LMZ21700SILT: 3V to 17V, 0.65A Step-Down DC/DC Power Module in 3.5mm 3.5mm Package Source: Datasheet <http://uk.rs-online.com/web/p/products/9009750P>; DESCRIPTION: 3V to 17V, 0.65A Step-Down DC/DC Power Module in 3.5mm 3.5mm Package; HEIGHT: mm; MANUFACTURER_NAME: Texas Instruments; MANUFACTURER_PART_NUMBER: LMZ21700SILT; RS_PART_NUMBER: 9009750P; RS_PRICE-STOCK: http://uk.rs-online.com/web/p/products/9009750P
J1 J3 = RescueRunner:505433-0871: CONN HEADER SMD 8POS 1.25MM Source: Datasheet <https://www.molex.com/pdm_docs/sd/5054330871_sd.pdf>; DESCRIPTION: CONN HEADER SMD 8POS 1.25MM; HEIGHT: 7.25mm; MANUFACTURER_NAME: Molex; MANUFACTURER_PART_NUMBER: 5054330871
J2 = RescueRunner:M300-MV31045M1: Headers & Wire Housings 10 WAY MALE PC TAIL DIL WJS Source: Datasheet <https://componentsearchengine.com/Datasheets/1/M300-MV31045M1.pdf>; DESCRIPTION: Headers & Wire Housings 10 WAY MALE PC TAIL DIL WJS; HEIGHT: 7.05mm; MANUFACTURER_NAME: HARWIN; MANUFACTURER_PART_NUMBER: M300-MV31045M1
K1-K3 = CASE-Relay:V23079A1003B301: V23079-A1003-B301 - DPDT non latch signal relay, 12VDC Description: V23079-A1003-B301 - DPDT non latch signal relay, through hole, 12VDC, 2A Rated current. Links: Datasheet <http://www.farnell.com/datasheets/1918069.pdf?_ga=2.91596121.236001324.1551687660-368635712.1550490484>; DESCRIPTION: DPDT non latch PCB relay, 5A 12Vdc coil; HEIGHT: 9mm; MANUFACTURER_NAME: TE Connectivity; MANUFACTURER_PART_NUMBER: V23079A1003B301; MOUSER_PART_NUMBER: 655-V23079A1003B301; MOUSER_PRICE-STOCK: https://www.mouser.com/Search/Refine.aspx?Keyword=655-V23079A1003B301
K4 = CASE-Relay:V23079A1001B301: V23079-A1001-B301 - DPDT non latch signal relay, 5VDC Description: V23079-A1003-B301 - DPDT non latch signal relay, through hole, 5VDC, 2A Rated current. Links: Datasheet <http://www.farnell.com/datasheets/1918069.pdf?_ga=2.91596121.236001324.1551687660-368635712.1550490484>; DESCRIPTION: DPDT non latch PCB relay, 5A 12Vdc coil; HEIGHT: 9mm; MANUFACTURER_NAME: TE Connectivity; MANUFACTURER_PART_NUMBER: V23079A1003B301; MOUSER_PART_NUMBER: 655-V23079A1003B301; MOUSER_PRICE-STOCK: https://www.mouser.com/Search/Refine.aspx?Keyword=655-V23079A1003B301
Q2 Q4-Q6 = CASE-Transistors:2N7002PW,115: 2N7002PW,115 N-Channel Mosfet (SOT-323) Description: 2N7002PW,115 N-Channel Mosfet in a SOT-323 (SC-70) package Links: 2N7002PW,115 <http://www.farnell.com/datasheets/1760698.pdf?_ga=2.3009012.510093211.1546607516-411290609.1543318711>
Q3 Q7 = CASE-Optocoupler:VO618A-3: VO618A-3 Description: VISHAY VO618A-3 Optocoupler in DIP-4 package. Links: Datasheet <http://www.farnell.com/datasheets/2049960.pdf?_ga=2.25273981.1789882356.1554397115-114062766.1547494298>
R1-R56 R61-R71 = CASE-RCL:R0603: Standard Chip RESISTOR 0603 (1608 Metric) Description: Standard Chip RESISTOR 0603 (1608 Metric)
S1 S3 = CASE-Switches:KMR621NGLFS: C&K KMR621NG LFS Tactile SPST switch (SMD) Description: C&K KMR621NG LFS Tactile SPST switch SMD package. Links: KMR621NG LFS <http://www.farnell.com/datasheets/2706242.pdf?_ga=2.40597409.2071720333.1546461288-1112771566.1525371275>
SWD1 SWD2 = CASE-Prog_Header:SWD_TAGCONNECT: SWD Programming header (Tag-Connect version) Description: SWD Programming header for Tag Connect TC2030-IDC, both legged and no-legged version Links: Tag-Connect <http://www.tag-connect.com/JLINK>
U1 U6 = CASE-MCU:STM32F303K8: STM32F303K8, LQFP-32 Description: STM32F303K8 from STMicroelectronics F3 series (Arm Cortex M4), LQFP-32 package Links: Datasheet <https://www.st.com/resource/en/datasheet/stm32f303k8.pdf> Website <https://www.st.com/en/microcontrollers/stm32f303k8.html> NUCLEO-F303K8 <https://www.st.com/en/evaluation-tools/nucleo-f303k8.html>; MANUFACTURER_PART_NUMBER: stm32f303_334kxt; VENDOR: STMicroelectronics
U2 U4 U5 = CASE-OP_AMP:TL074ID: TL074ID Quad Low-Noise JFET-Input General-Purpose Operational Amplifier Description: TL074ID Quad Low-Noise JFET-Input General-Purpose Operational Amplifier in SOIC-14 package Links: Datasheet <http://www.ti.com/lit/ds/symlink/tl072.pdf>; DESCRIPTION: Quad Low-Noise JFET-Input General-Purpose Operational Amplifier; HEIGHT: 1.75mm; MANUFACTURER_NAME: Texas Instruments; MANUFACTURER_PART_NUMBER: TL074ID; MOUSER_PART_NUMBER: 595-TL074ID; MOUSER_PRICE-STOCK: https://www.mouser.com/Search/Refine.aspx?Keyword=595-TL074ID
U3 = CASE-Voltage_regulators:LD1117S33TR: LD1117S33TR, 3.3V LDO voltage regulator, SOT-223-4 Description: LD1117S33TR, 3.3V LDO voltage regulator in SOT-223-3 package - Input voltage: 4.75-15V - Output voltage: 3.3V - Output current: 800mA - Dropout voltage: 1.1V Links: Datasheet <http://www.farnell.com/datasheets/1776449.pdf?_ga=2.71508627.1869469127.1547838600-114062766.1547494298>; MPN: LD1117S33TR; OC_FARNELL: 2253484; OC_NEWARK: 89K0627; PACKAGE: SOT223-3; SUPPLIER: STMicroelectronics
U$1-U$10 = RescueRunner:M3_MOUNTING_HOLE

## Net classes
0 default: width 0.2 mm
1 12VPower: width 3.81 mm